# Altium schematic sheet FE_PA_LDOs.SchDoc: FMC SDR Frontend
size 420 x 297 mm; EDA_Number: EDA-XXXXX-VX-X; Projet: -; ModifiedBy: -; CreateDate: XX/XX/XXXX; CheckedDate: -; Title2: PA Power Supply LDOs; DivGrp: TE/MPE; Designer: Designer
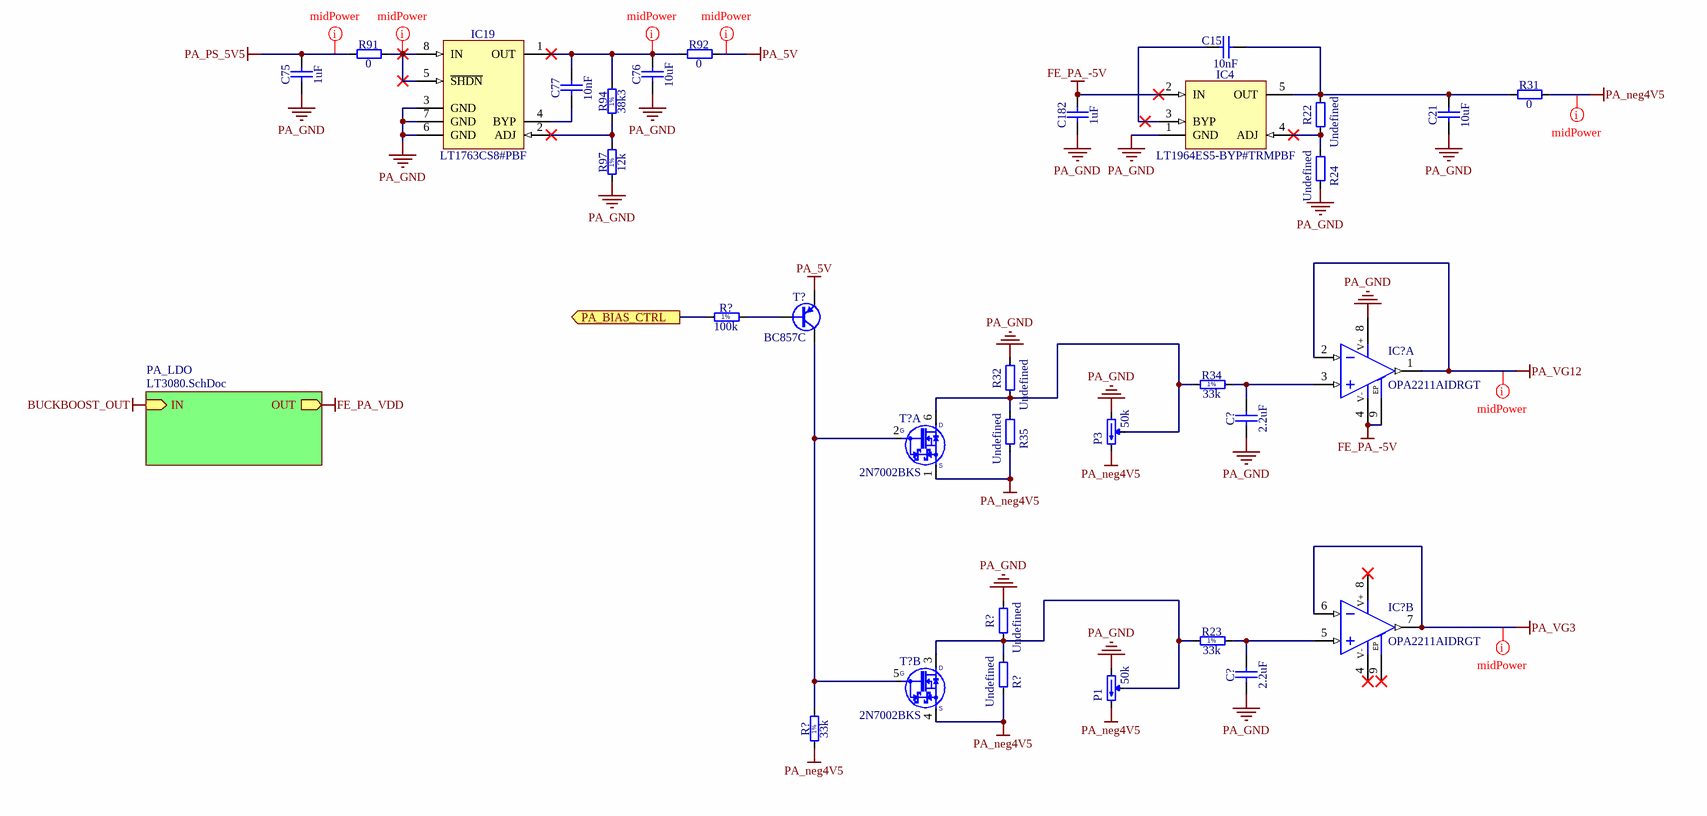
[diagram p0: FE_PA_LDOs.SchDoc]

## Parts
(Parts that share a designator on the sheet are numbered #1, #2 ... from top to bottom, then left to right.)
C15  10nF  [CAPC1608X87N]
C21  10uF  [CAPC2012X95N]
C75  1uF  [CAPC1608X87N]
C76  10uF  [CAPC2012X95N]
C77  10nF  [CAPC1005X55N]
C182  1uF  [CAPC1608X87N]
C?#1  2.2uF  [CAPC2012X135N]
C?#2  2.2uF  [CAPC2012X135N]
IC4  LT1964ES5-BYP#TRMPBF  [SOT95P280X100-5N]
IC19  LT1763CS8#PBF  [SOIC127P600X175-8N]
IC?#1  OPA2211AIDRGT  [SON50P300X300X80-9N-R155X250]  (part A of 2)
IC?#2  OPA2211AIDRGT  [SON50P300X300X80-9N-R155X250]  (part B of 2)
P1  50k  [TRIM_BOURNS_3223W]
P3  50k  [TRIM_BOURNS_3223W]
R22  Undefined  [RESC1608X55N]
R23  33k  [RESC1005X40N]
R24  Undefined  [RESC1608X55N]
R31  0  [RESC1608X55N]
R32  Undefined  [RESC1608X55N]
R34  33k  [RESC1005X40N]
R35  Undefined  [RESC1608X55N]
R91  0  [RESC1608X55N]
R92  0  [RESC1608X55N]
R94  38k3  [RESC1005X40N]
R97  12k  [RESC1005X40N]
R?#1  100k  [RESC1608X55N]
R?#2  Undefined  [RESC1608X55N]
R?#3  Undefined  [RESC1608X55N]
R?#4  33k  [RESC1608X55N]
T?#1  BC857C  [SOT95P240X110-3N]
T?#2  2N7002BKS  [SOT65P210X110-6N]  (part A of 2)
T?#3  2N7002BKS  [SOT65P210X110-6N]  (part B of 2)

## Sub-sheets
PA_LDO = LT3080.SchDoc: IN (in), OUT (out)

## Ports
PA_BIAS_CTRL (out)

## Nets
BUCKBOOST_OUT: sheet PA_LDO/IN
FE_PA_-5V: C182.2 IC4.2(IN) IC?#1.4(V-) IC?#1.9(Exposed_Pad)
FE_PA_VDD: sheet PA_LDO/OUT
PA_5V: R92.2 T?#1.2(E)
PA_GND: C21.1 C75.1 C76.1 C182.1 C?#1.1 C?#2.1 IC4.1(GND) IC19.3(GND) IC19.6(GND) IC19.7(GND) IC?#1.8(V+) P1.1(CCW) P3.1(CCW) R24.1 R32.2 R97.1 R?#2.2
PA_neg4V5: P1.3(CW) P3.3(CW) R31.2 R35.1 R?#3.1 R?#4.1 T?#2.1(S) T?#3.4(S)
PA_PS_5V5: C75.2 R91.1
PA_VG3: IC?#2.6(IN-) IC?#2.7(OUT)
PA_VG12: IC?#1.1(OUT) IC?#1.2(IN-)
PA_BIAS_CTRL: R?#1.1 ; port PA_BIAS_CTRL
NetC15_1: C15.1 IC4.3(BYP)
NetC15_2: C15.2 C21.2 IC4.5(OUT) R22.2 R31.1
NetC76_2: C76.2 C77.2 IC19.1(OUT) R92.1 R94.2
NetC77_1: C77.1 IC19.4(BYP)
NetC?#1_2: C?#1.2 IC?#1.3(IN+) R34.2
NetC?#2_2: C?#2.2 IC?#2.5(IN+) R23.2
NetIC4_4: IC4.4(ADJ) R22.1 R24.2
NetIC19_2: IC19.2(ADJ) R94.1 R97.2
NetIC19_5: IC19.5(~{SHDN}) IC19.8(IN) R91.2
NetP1_2: P1.2(W) R23.1 R?#2.1 R?#3.2 T?#3.3(D)
NetP3_2: P3.2(W) R32.1 R34.1 R35.2 T?#2.6(D)
NetR?#1_2: R?#1.2 T?#1.1(B)
NetR?#4_2: R?#4.2 T?#1.3(C) T?#2.2(G) T?#3.5(G)

Not connected (* = marked no-connect by the designer): IC?#2 4(V-)* 8(V+)* 9(Exposed_Pad)*

## Layout directives
net class midPower: NetC76_2, NetIC19_5, PA_5V, PA_neg4V5, PA_PS_5V5, PA_VG3, PA_VG12

## Notes on the sheet
- Project/Equipment
- Document
- Designer
- Drawn by
- Check.by
- File
- Last Mod.
- Print Date
- Sheet
- Size
- A3
- of
- Rev
- (in symbol OPA2211AIDRGT, part A) EP
- (in symbol OPA2211AIDRGT, part B) EP
- (in symbol R0402_12K_1%_0.0625W_100PPM) 1%
- (in symbol R0402_33K_1%_0.0625W_100PPM) 1%
- (in symbol R0402_38K3_1%_0.0625W_100PPM) 1%
- (in symbol R0603_33K_1%_0.1W_100PPM) 1%
- (in symbol R0603_100K_1%_0.1W_100PPM) 1%

## Library data of the parts
C15 = CC0603_10NF_50V_5%_C0G: Non-polarised capacitor; Part Description: SMD Multilayer Chip Ceramic Capacitor; Manufacturer: GENERIC; Manufacturer1 Part Number: C1608C0G1H103J080AA; Voltage: 50V; TC: C0G/NP0; Tolerance: ±5%; Part Number: CC0603_10NF_50V_5%_C0G; Component Kind: Standard; Component Type: Standard; Pin Count: 2; Value: 10nF; Status: Preferred; Manufacturer Part Number: CC0603_10NF_50V_5%_C0G; Case: 0603; Mounted: Yes; Socket: No; SMD: Yes; Sense: No; Manufacturer1 Example: TDK; Manufacturer1 ComponentHeight: 0.9mm; HelpURL: \\cern.ch\dfs\Applications\Altium\Datasheets\CC0603_C0G_TDK_C.pdf; Author: CERN DEM JLC; CreateDate: 10.12.2014; LatestRevisionDate: 10.12.2014
C21 C76 = CC0805_10UF_25V_10%_X5R: Non-polarised capacitor; Part Description: SMD Multilayer Chip Ceramic Capacitor; Manufacturer: GENERIC; Manufacturer1 Part Number: GRM219R61E106KA12D; Voltage: 25V; TC: X5R; Tolerance: ±10%; Part Number: CC0805_10UF_25V_10%_X5R; Component Kind: Standard; Component Type: Standard; Pin Count: 2; Value: 10uF; Status: Preferred; Manufacturer Part Number: CC0805_10UF_25V_10%_X5R; Case: 0805; Mounted: Yes; Socket: No; SMD: Yes; Sense: No; Manufacturer1 Example: MURATA; Manufacturer1 ComponentHeight: 0.95mm; HelpURL: \\cern.ch\dfs\Applications\Altium\Datasheets\CC0805_X5R_MURATA_GRM.pdf; Author: CERN DEM JLC; CreateDate: 25/10/2012; LatestRevisionDate: 06/09/2016
C75 C182 = CC0603_1UF_25V_10%_X7R: Non-polarised capacitor; Part Description: SMD Multilayer Chip Ceramic Capacitor; Manufacturer: GENERIC; Manufacturer1 Part Number: GRM188R71E105KA12D; Voltage: 25V; TC: X7R; Tolerance: ±10%; Part Number: CC0603_1UF_25V_10%_X7R; Component Kind: Standard; Component Type: Standard; Pin Count: 2; Value: 1uF; Status: None; Manufacturer Part Number: CC0603_1UF_25V_10%_X7R; Case: 0603; Mounted: Yes; Socket: No; SMD: Yes; Sense: No; Manufacturer1 Example: MURATA; Manufacturer1 ComponentHeight: 0.9mm; HelpURL: \\cern.ch\dfs\Applications\Altium\Datasheets\CC0603_X7R_MURATA.pdf; Author: CERN DEM JLC; CreateDate: 18/01/2011; LatestRevisionDate: 18/01/2011
C77 = CC0402_10NF_50V_10%_X7R: Non-polarised capacitor; Part Description: SMD Multilayer Chip Ceramic Capacitor; Manufacturer: GENERIC; Manufacturer1 Part Number: GRM155R71H103KA88D; Voltage: 50V; TC: X7R; Tolerance: ±10%; Part Number: CC0402_10NF_50V_10%_X7R; Component Kind: Standard; Component Type: Standard; Pin Count: 2; Value: 10nF; Status: None; Manufacturer Part Number: CC0402_10NF_50V_10%_X7R; Case: 0402; Mounted: Yes; Socket: No; SMD: Yes; Sense: No; Manufacturer1 Example: MURATA; Manufacturer1 ComponentHeight: 0.55mm; HelpURL: \\cern.ch\dfs\Applications\Altium\Datasheets\CC0402_X7R_MURATA_GRM.pdf; Author: CERN DEM MR; CreateDate: 08.01.2016; LatestRevisionDate: 08.01.2016
C?#1 C?#2 = CC0805_2.2UF_16V_10%_X7R: Non-polarised capacitor; Part Description: SMD Multilayer Chip Ceramic Capacitor; Manufacturer: GENERIC; Manufacturer1 Part Number: GRM21BF51C225ZA01L; Voltage: 16V; TC: X7R; Tolerance: ±10%; Part Number: CC0805_2.2UF_16V_10%_X7R; Component Kind: Standard; Component Type: Standard; Pin Count: 2; Value: 2.2uF; Status: Preferred; Manufacturer Part Number: CC0805_2.2UF_16V_10%_X7R; Case: 0805; Mounted: Yes; Socket: No; SMD: Yes; Sense: No; Manufacturer1 Example: MURATA; Manufacturer1 ComponentHeight: 1.5mm; HelpURL: \\cern.ch\dfs\Applications\Altium\Datasheets\CC0805_X7R_MURATA_GRM.pdf; Author: CERN DEM JLC; CreateDate: 03.12.2007; LatestRevisionDate: 18.09.2014
IC4 = LT1964ES5-BYP#TRMPBF: 200mA, Low Noise, Low Dropout Negative Micropower Regulator; Part Description: -1.22V to -20V, 200mA, Low Noise, Low Dropout Negative Micropower Regulator; Manufacturer: LINEAR TECHNOLOGY; PressFit: No; Bonding: No; Part Number: LT1964ES5-BYP#TRMPBF; Component Kind: Standard; Component Type: Standard; Device: LT1964ES5-BYP#TRMPBF; PackageDescription: SOT23, 0.95mm pitch; 5 pin, 1.75mm W X 3.00mm L, IPC Medium Density; Manufacturer Part Number: LT1964ES5-BYP#TRMPBF; Pin Count: 5; Case: SOT23-5; Mounted: Yes; Socket: No; SMD: Yes; Sense: No; ComponentHeight: 1mm; HelpURL: \\cern.ch\dfs\Applications\Altium\Datasheets\LT1964ES5-BYP#TRMPBF.pdf; Author: CERN DEM MR; CreateDate: 17.02.2016; LatestRevisionDate: 17.02.2016
IC19 = LT1763CS8#PBF: 1.22V to 20V 500mA, Low Noise, LDO Adjustable Micropower Regulator; Manufacturer: LINEAR TECHNOLOGY; PressFit: No; Bonding: No; Part Number: LT1763CS8#PBF; Component Kind: Standard; Component Type: Standard; Device: LT1763CS8#PBF; PackageDescription: SOIC 8, Pitch 1.27mm, Body 4x5mm, IPC Medium Density; Part Description: 1.22V to 20V 500mA, Low Noise, LDO Adjustable Micropower Regulator; Manufacturer Part Number: LT1763CS8#PBF; Pin Count: 8; Case: SOIC8; Mounted: Yes; Socket: No; SMD: Yes; Sense: No; ComponentHeight: 1.75mm; HelpURL: \\cern.ch\dfs\Applications\Altium\Datasheets\LT1763CS8#PBF.pdf; Author: CERN DEM JLC; CreateDate: 11.01.2010; LatestRevisionDate: 11.01.2010
IC?#1 IC?#2 = OPA2211AIDRGT: Dual Operational Amplifier With Exposed Pad; Part Description: 1.1nV/sqrt Hz Noise, Low Power, PrecisionOperational Amplifier; Manufacturer: TEXAS INSTRUMENTS; PressFit: No; Bonding: No; Part Number: OPA2211AIDRGT; Component Kind: Standard; Component Type: Standard; Device: OPA2211AIDRGT; PackageDescription: SON,  0.50mm Pitch, 8 Pin, 3mm X 3mm X 0.8mm H Body (w/Thermal Tab 1.55 X 2.5mm),  IPC Medium Density; Manufacturer Part Number: OPA2211AIDRGT; Pin Count: 9; Case: SON8; Mounted: Yes; Socket: No; SMD: Yes; Sense: No; ComponentHeight: 0.8mm; Author: CERN DEM JLC; HelpURL: \\cern.ch\dfs\Applications\Altium\Datasheets\OPA2211AIDRGT.pdf; CreateDate: 17.11.2014; LatestRevisionDate: 17.11.2014
P1 P3 = TRIM_11T_50K_BOURNS_3223W-1-503E: Trimming Potentiometer; Part Description: 11 Turns SMD Trimpot® Trimming Potentiometer (Top Adjust); Manufacturer: BOURNS; Power: 0.125W; TC: ±100ppm/°C; Tolerance: ±20%; PressFit: No; Part Number: TRIM_11T_50K_BOURNS_3223W-1-503E; Component Kind: Standard; Component Type: Standard; Pin Count: 3; Value: 50k; Manufacturer Part Number: 3223W-1-503E; Case: 3223W; Mounted: Yes; Socket: No; SMD: Yes; Sense: No; ComponentHeight: 4.16mm; HelpURL: \\cern.ch\dfs\Applications\Altium\Datasheets\TRIM_BOURNS_3223W.pdf; Author: CERN DEM JLC; CreateDate: 31.03.2011; LatestRevisionDate: 18.12.2012
R22 R24 R32 R35 R?#2 R?#3 = R0603_NO-VALUE: Resistor; Part Description: Reserved Footprint For a 0603 (1608) Chip Resistor; PressFit: No; Mounted: No; Part Number: R0603_NO-VALUE; Component Kind: Standard; Component Type: Standard; Pin Count: 2; Value: Undefined; Status: None; Manufacturer: Undefined; Manufacturer Part Number: R0603_NO-VALUE; Case: 0603; Sense: No; Socket: No; SMD: Yes; Manufacturer1 Example: Undefined; Manufacturer1 Part Number: Undefined; Manufacturer1 ComponentHeight: Undefined; HelpURL: Undefined; Author: CERN DEM JLC; CreateDate: 03.12.2007; LatestRevisionDate: 13.03.2008
R23 R34 = R0402_33K_1%_0.0625W_100PPM: Resistor - 1%; Part Description: General Purpose Thick Film Chip Resistor; Manufacturer: GENERIC; Manufacturer1 Part Number: 232270673303L; TC: ±100ppm/°C; PressFit: No; Part Number: R0402_33K_1%_0.0625W_100PPM; Component Kind: Standard; Component Type: Standard; Pin Count: 2; Value: 33k; Status: Not Recommended; Power: 0.0625W; Tolerance: ±1%; Manufacturer Part Number: R0402_33K_1%_0.0625W_100PPM; Case: 0402; Mounted: Yes; Sense: No; Socket: No; SMD: Yes; Manufacturer1 Example: YAGEO PHYCOMP; Manufacturer1 ComponentHeight: 0.4mm; HelpURL: \\cern.ch\dfs\Applications\Altium\Datasheets\R0402_Phycomp_RC0402.pdf; Author: CERN DEM JLC; CreateDate: 03.12.2007; LatestRevisionDate: 17.10.2012
R31 R91 R92 = R0603_0R_JUMPER: Resistor; Part Description: 1A (0.05R Max DC Resistance) Zero Ohm Jumper; Manufacturer: GENERIC; Manufacturer1 Part Number: NRC06Z0; PressFit: No; Part Number: R0603_0R_JUMPER; Component Kind: Standard; Component Type: Standard; Pin Count: 2; Value: 0; Status: Preferred; Manufacturer Part Number: R0603_0R_JUMPER; Case: 0603; Mounted: Yes; Sense: No; Socket: No; SMD: Yes; Manufacturer1 Example: NIC COMPONENT; Manufacturer1 ComponentHeight: 0.55mm; HelpURL: \\cern.ch\dfs\Applications\Altium\Datasheets\R0603_NIC_NRC.pdf; Author: CERN DEM JLC; CreateDate: 03.12.2007; LatestRevisionDate: 13.03.2008
R94 = R0402_38K3_1%_0.0625W_100PPM: Resistor - 1%; Part Description: General Purpose Thick Film Chip Resistor; Manufacturer: GENERIC; Manufacturer1 Part Number: 232270673833L or RC0402FR-0738K3L; TC: ±100ppm/°C; PressFit: No; Part Number: R0402_38K3_1%_0.0625W_100PPM; Component Kind: Standard; Component Type: Standard; Pin Count: 2; Value: 38k3; Status: Not Recommended; Power: 0.0625W; Tolerance: ±1%; Manufacturer Part Number: R0402_38K3_1%_0.0625W_100PPM; Case: 0402; Mounted: Yes; Sense: No; Socket: No; SMD: Yes; Manufacturer1 Example: YAGEO PHYCOMP; Manufacturer1 ComponentHeight: 0.4mm; HelpURL: \\cern.ch\dfs\Applications\Altium\Datasheets\R0402_Phycomp_RC0402.pdf; Author: CERN DEM BC; CreateDate: 29.07.2015; LatestRevisionDate: 29.07.2015
R97 = R0402_12K_1%_0.0625W_100PPM: Resistor - 1%; Part Description: General Purpose Thick Film Chip Resistor; Manufacturer: GENERIC; Manufacturer1 Part Number: 232270671203L; TC: ±100ppm/°C; PressFit: No; Part Number: R0402_12K_1%_0.0625W_100PPM; Component Kind: Standard; Component Type: Standard; Pin Count: 2; Value: 12k; Status: Not Recommended; Power: 0.0625W; Tolerance: ±1%; Manufacturer Part Number: R0402_12K_1%_0.0625W_100PPM; Case: 0402; Mounted: Yes; Sense: No; Socket: No; SMD: Yes; Manufacturer1 Example: YAGEO PHYCOMP; Manufacturer1 ComponentHeight: 0.4mm; HelpURL: \\cern.ch\dfs\Applications\Altium\Datasheets\R0402_Phycomp_RC0402.pdf; Author: CERN DEM JLC; CreateDate: 03.12.2007; LatestRevisionDate: 17.10.2012
R?#1 = R0603_100K_1%_0.1W_100PPM: Resistor - 1%; Part Description: General Purpose Thick Film Chip Resistor; Manufacturer: GENERIC; Manufacturer1 Part Number: NRC06F1003TRF; Power: 0.1W; TC: ±100ppm/°C; PressFit: No; Part Number: R0603_100K_1%_0.1W_100PPM; Component Kind: Standard; Component Type: Standard; Pin Count: 2; Value: 100k; Status: Preferred; Tolerance: ±1%; Manufacturer Part Number: R0603_100K_1%_0.1W_100PPM; Case: 0603; Mounted: Yes; Sense: No; Socket: No; SMD: Yes; Manufacturer1 Example: NIC COMPONENT; Manufacturer1 ComponentHeight: 0.55mm; HelpURL: \\cern.ch\dfs\Applications\Altium\Datasheets\R0603_NIC_NRC.pdf; Author: CERN DEM JLC; CreateDate: 03.12.2007; LatestRevisionDate: 13.03.2008
R?#4 = R0603_33K_1%_0.1W_100PPM: Resistor - 1%; Part Description: General Purpose Thick Film Chip Resistor; Manufacturer: GENERIC; Manufacturer1 Part Number: NRC06F3302TRF; Power: 0.1W; TC: ±100ppm/°C; PressFit: No; Part Number: R0603_33K_1%_0.1W_100PPM; Component Kind: Standard; Component Type: Standard; Pin Count: 2; Value: 33k; Status: Preferred; Tolerance: ±1%; Manufacturer Part Number: R0603_33K_1%_0.1W_100PPM; Case: 0603; Mounted: Yes; Sense: No; Socket: No; SMD: Yes; Manufacturer1 Example: NIC COMPONENT; Manufacturer1 ComponentHeight: 0.55mm; HelpURL: \\cern.ch\dfs\Applications\Altium\Datasheets\R0603_NIC_NRC.pdf; Author: CERN DEM JLC; CreateDate: 03.12.2007; LatestRevisionDate: 13.03.2008
T?#1 = BC857C: PNP Transistor; Part Description: 45V 100mA PNP  Silicon AF Transistor; Manufacturer: INFINEON; PressFit: No; Bonding: No; Part Number: BC857C; Component Kind: Standard; Component Type: Standard; Device: BC857C; PackageDescription: SOT23 3-Leads, Pitch 0.95mm - Body 1.3x2.9mm, IPC Medium Density; Manufacturer Part Number: BC857C; Pin Count: 3; Case: SOT23-3; Mounted: Yes; Socket: No; SMD: Yes; Sense: No; ComponentHeight: 1.1mm; HelpURL: \\cern.ch\dfs\Applications\Altium\Datasheets\BC857C.pdf; Author: CERN DEM JLC; CreateDate: 23.09.2014; LatestRevisionDate: 23.09.2014
T?#2 T?#3 = 2N7002BKS: 60V, 300mA Dual N-Channel Trench MOSFET; Manufacturer: NXP SEMICONDUCTORS; Manufacturer Part Number: 2N7002BKS6; PressFit: No; Bonding: No; Part Number: 2N7002BKS; Component Kind: Standard; Component Type: Standard; Device: 2N7002BKS; PackageDescription: SOT363, SC70-6, SOT, 0.65mm Pitch, 6 pin, 1.25mm W X 2.00mm L X 1.10mm H, IPC Medium Density; Part Description: 60 V, 300 mA Dual N-Channel Trench MOSFET; Pin Count: 4; Case: SOT363; Mounted: Yes; Socket: No; SMD: Yes; Sense: No; ComponentHeight: 1.1mm; HelpURL: \\cern.ch\dfs\Applications\Altium\Datasheets\2N7002BKS.pdf; Author: CERN DEM JLC; CreateDate: 27.11.2012; LatestRevisionDate: 27.11.2012